# EAGLE design MainBoard (EAGLE 8.5.0)
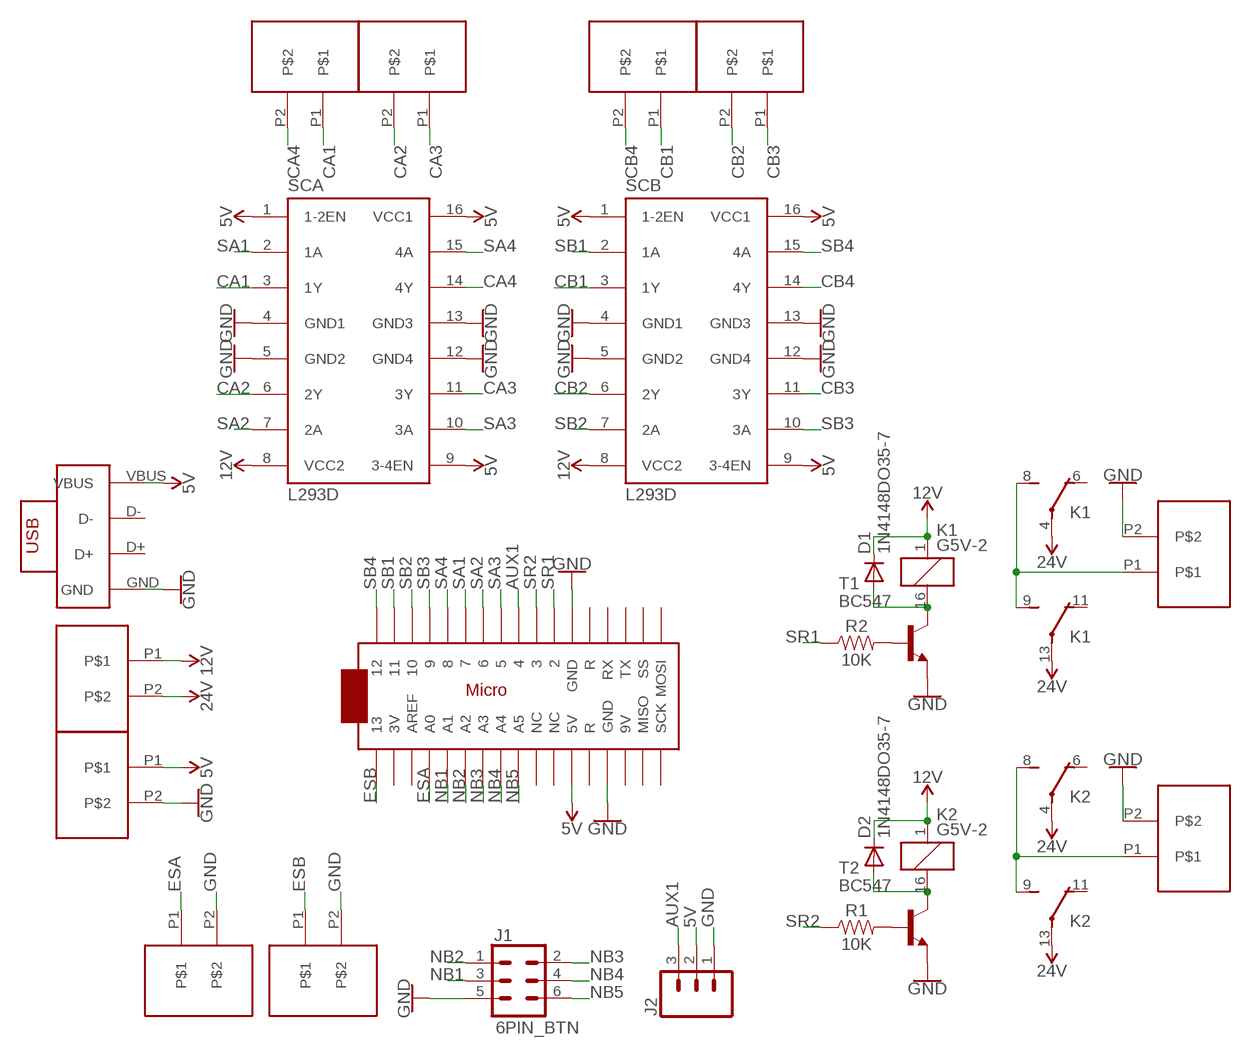
[diagram p0: schematic, sheet 1]

## Parts
5V/GND  PRT-08432  [PRT-08432]
12/24V  PRT-08432  [PRT-08432]
D1  1N4148DO35-7  [DO35-7]
D2  1N4148DO35-7  [DO35-7]
ESA  PRT-08432  [PRT-08432]
ESB  PRT-08432  [PRT-08432]
J1  6PIN_BTN  CONN_03X22X3_SILK_MALE_PTH  [2X3]
J2  CONN_03  [1X03]
K1  G5V-2  [G5V-2]
K2  G5V-2  [G5V-2]
R1  10K  RESISTORAXIAL-0.3  [AXIAL-0.3]
R2  10K  RESISTORAXIAL-0.3  [AXIAL-0.3]
SCA  L293D  [DIL16]
SCA12  PRT-08432  [PRT-08432]
SCA34  PRT-08432  [PRT-08432]
SCB  L293D  [DIL16]
SCB12  PRT-08432  [PRT-08432]
SCB34  PRT-08432  [PRT-08432]
SR1  PRT-08432  [PRT-08432]
SR2  PRT-08432  [PRT-08432]
T1  BC547  [TO92]
T2  BC547  [TO92]
U$1  ARDUINOMICRO  [ARDUINOMICRO]
U$2  USB_EXP_BOARD  [USB_EXPANSION]

## Nets
5V: 5V/GND.P1 J2.2 SCA.1(1-2EN) SCA.9(3-4EN) SCA.16(VCC1) SCB.1(1-2EN) SCB.9(3-4EN) SCB.16(VCC1) U$1.P$23(5V) U$2.VBUS
12V: 12/24V.P1 D1.C D2.C K1.1 K2.1 SCA.8(VCC2) SCB.8(VCC2)
AUX1: J2.3 U$1.P$9
CA1: SCA12.P1 SCA.3(1Y)
CA2: SCA34.P2 SCA.6(2Y)
CA3: SCA34.P1 SCA.11(3Y)
CA4: SCA12.P2 SCA.14(4Y)
CB1: SCB12.P1 SCB.3(1Y)
CB2: SCB34.P2 SCB.6(2Y)
CB3: SCB34.P1 SCB.11(3Y)
CB4: SCB12.P2 SCB.14(4Y)
ESA: ESA.P1 U$1.P$31(A0)
ESB: ESB.P1 U$1.P$34
GND: 5V/GND.P2 ESA.P2 ESB.P2 J1.5 J2.1 SCA.4(GND1) SCA.5(GND2) SCA.12(GND4) SCA.13(GND3) SCB.4(GND1) SCB.5(GND2) SCB.12(GND4) SCB.13(GND3) SR1.P2 SR2.P2 T1.1(E) T2.1(E) U$1.P$12(GND) U$1.P$21(GND) U$2.GND
N$1: D2.A K2.16 T2.3(C)
N$3: D1.A K1.16 T1.3(C)
N$5: R1.P$2 T2.2(B)
N$6: R2.P$2 T1.2(B)
NB1: J1.3 U$1.P$30(A1)
NB2: J1.1 U$1.P$29(A2)
NB3: J1.2 U$1.P$28(A3)
NB4: J1.4 U$1.P$27(A4)
NB5: J1.6 U$1.P$26(A5)
RT1: K1.8(1:S) K1.9(2:S) SR1.P1
RT2: K2.8(1:S) K2.9(2:S) SR2.P1
SA1: SCA.2(1A) U$1.P$6
SA2: SCA.7(2A) U$1.P$7
SA3: SCA.10(3A) U$1.P$8
SA4: SCA.15(4A) U$1.P$5
SB1: SCB.2(1A) U$1.P$2
SB2: SCB.7(2A) U$1.P$3
SB3: SCB.10(3A) U$1.P$4
SB4: SCB.15(4A) U$1.P$1
SR1: R2.P$1 U$1.P$11
SR2: R1.P$1 U$1.P$10
VCC: 12/24V.P2 K1.4(1:P) K1.13(2:P) K2.4(1:P) K2.13(2:P) ; supply symbol labelled 24V
Unconnected: K1.6(1:O) K1.11(2:O) K2.6(1:O) K2.11(2:O) U$1.P$13(R) U$1.P$14(RX) U$1.P$15(TX) U$1.P$16(SS) U$1.P$17(MOSI) U$1.P$18(SCK) U$1.P$19(MISO) U$1.P$20(9V) U$1.P$22(R) U$1.P$24(NC) U$1.P$25(NC) U$1.P$32(AREF) U$1.P$33(3V) U$2.D+ U$2.D-

## Library data of the parts
5V/GND 12/24V ESA ESB SCA12 SCA34 SCB12 SCB34 SR1 SR2 = Screw Terminals:PRT-08432: Two pin screw terminal
D1 D2 = HTXstuff:1N4148: DIODE high speed (Philips)
J1 = SparkFun-Connectors:CONN_03X2: Multi connection point. Often used as Generic Header-pin footprint for 0.1 inch spaced/style header connections You can populate with any combo of single row headers, but if you'd like an exact match, check these: Header - 2x3 (Male, 0.1") <https://www.sparkfun.com/products/12807> (PRT-12807) Header - 2x3 (Female, 0.1") <https://www.sparkfun.com/products/13010> (PRT-13010) 2x3 Pin Shrouded Header <https://www.sparkfun.com/products/10877> (PRT-10877) On any of the 0.1 inch spaced packages, you can populate with these: Break Away Headers - Straight <https://www.sparkfun.com/products/116> (PRT-00116) Break Away Male Headers - Right Angle <https://www.sparkfun.com/products/553> (PRT-00553) Female Headers <https://www.sparkfun.com/products/115> (PRT-00115) Break Away Headers - Machine Pin <https://www.sparkfun.com/products/117> (PRT-00117) Break Away Female Headers - Swiss Machine Pin <https://www.sparkfun.com/products/743> (PRT-00743) Special note: the shrouded connector mates well with our 3x2 ribbon cables: Ribbon Crimp Connector - 6-pin (2x3, Female) <https://www.sparkfun.com/products/10651> (PRT-10651) Ribbon Cable - 6 wire (15ft) <https://www.sparkfun.com/products/10646> (PRT-10646); PROD_ID: CONN-09701
J2 = SparkFun-Connectors:CONN_03: Multi connection point. Often used as Generic Header-pin footprint for 0.1 inch spaced/style header connections On any of the 0.1 inch spaced packages, you can populate with these: Break Away Headers - Straight <https://www.sparkfun.com/products/116> (PRT-00116) Break Away Male Headers - Right Angle <https://www.sparkfun.com/products/553> (PRT-00553) Female Headers <https://www.sparkfun.com/products/115> (PRT-00115) Break Away Headers - Machine Pin <https://www.sparkfun.com/products/117> (PRT-00117) Break Away Female Headers - Swiss Machine Pin <https://www.sparkfun.com/products/743> (PRT-00743) Stackable Header - 3 Pin (Female, 0.1") <https://www.sparkfun.com/products/13875> (PRT-13875) For SCREWTERMINALS and SPRING TERMINALS visit here: Screw Terimnals on SparkFun.com <https://www.sparkfun.com/search/results?term=Screw+Terminals> (5mm/3.5mm/2.54mm spacing) This device is also useful as a general connection point to wire up your design to another part of your project. Our various solder wires solder well into these plated through hole pads. Hook-Up Wire - Assortment (Stranded, 22 AWG) <https://www.sparkfun.com/products/11375> (PRT-11375) Hook-Up Wire - Assortment (Solid Core, 22 AWG) <https://www.sparkfun.com/products/11367> (PRT-11367) View the entire wire category on our website here <https://www.sparkfun.com/categories/141> Special notes: Molex polarized connector foot print use with SKU : PRT-08232 with associated crimp pins and housings.
K1 K2 = relay:G5V-2: OMRON PCB Relay Source: http://www.omron.com/ecb/products/pdf/en-g5v2.pdf; MPN: G5V-2 5DC; OC_FARNELL: 9949488; OC_NEWARK: 78K5703
R1 R2 = SparkFun-Resistors:RESISTOR: Generic Resistor Package
SCA SCB = HTXstuff:L293D: PUSH-PULL 4 CHANNEL DRIVER; MPN: L293D; OC_FARNELL: 9589619; OC_NEWARK: 56P8249
T1 T2 = HTXstuff:BC547: NPN TRANSISTOR
U$1 = HTXstuff:ARDUINOMICRO
U$2 = HTXstuff:USB_EXP_BOARD

## Board
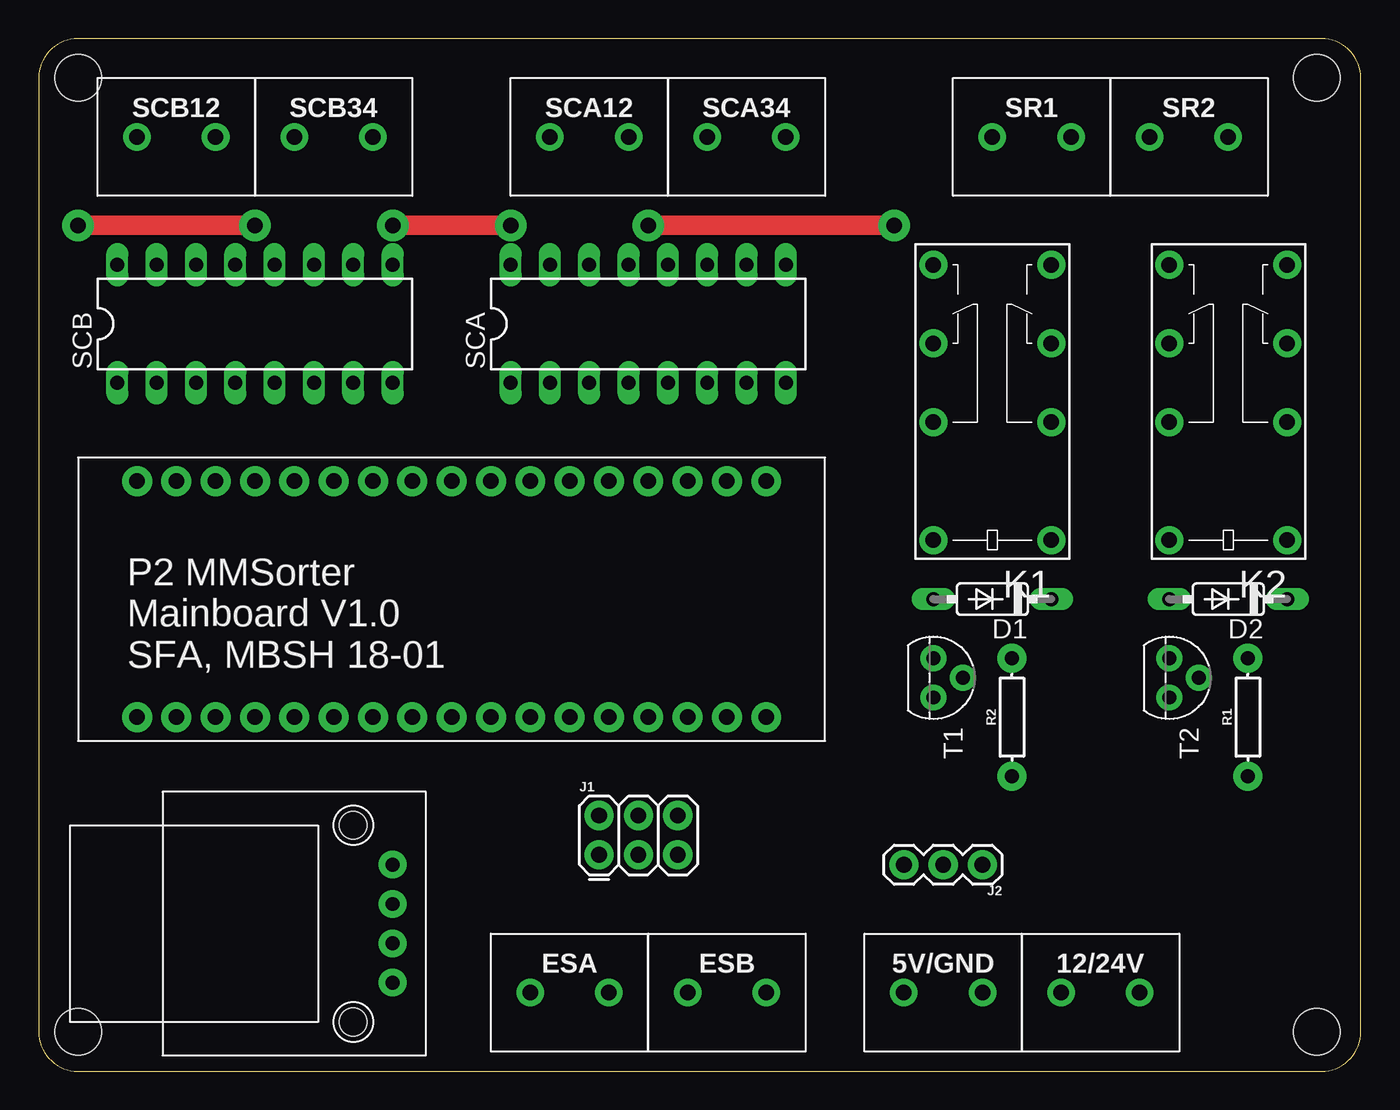
[diagram p1: board, top side]
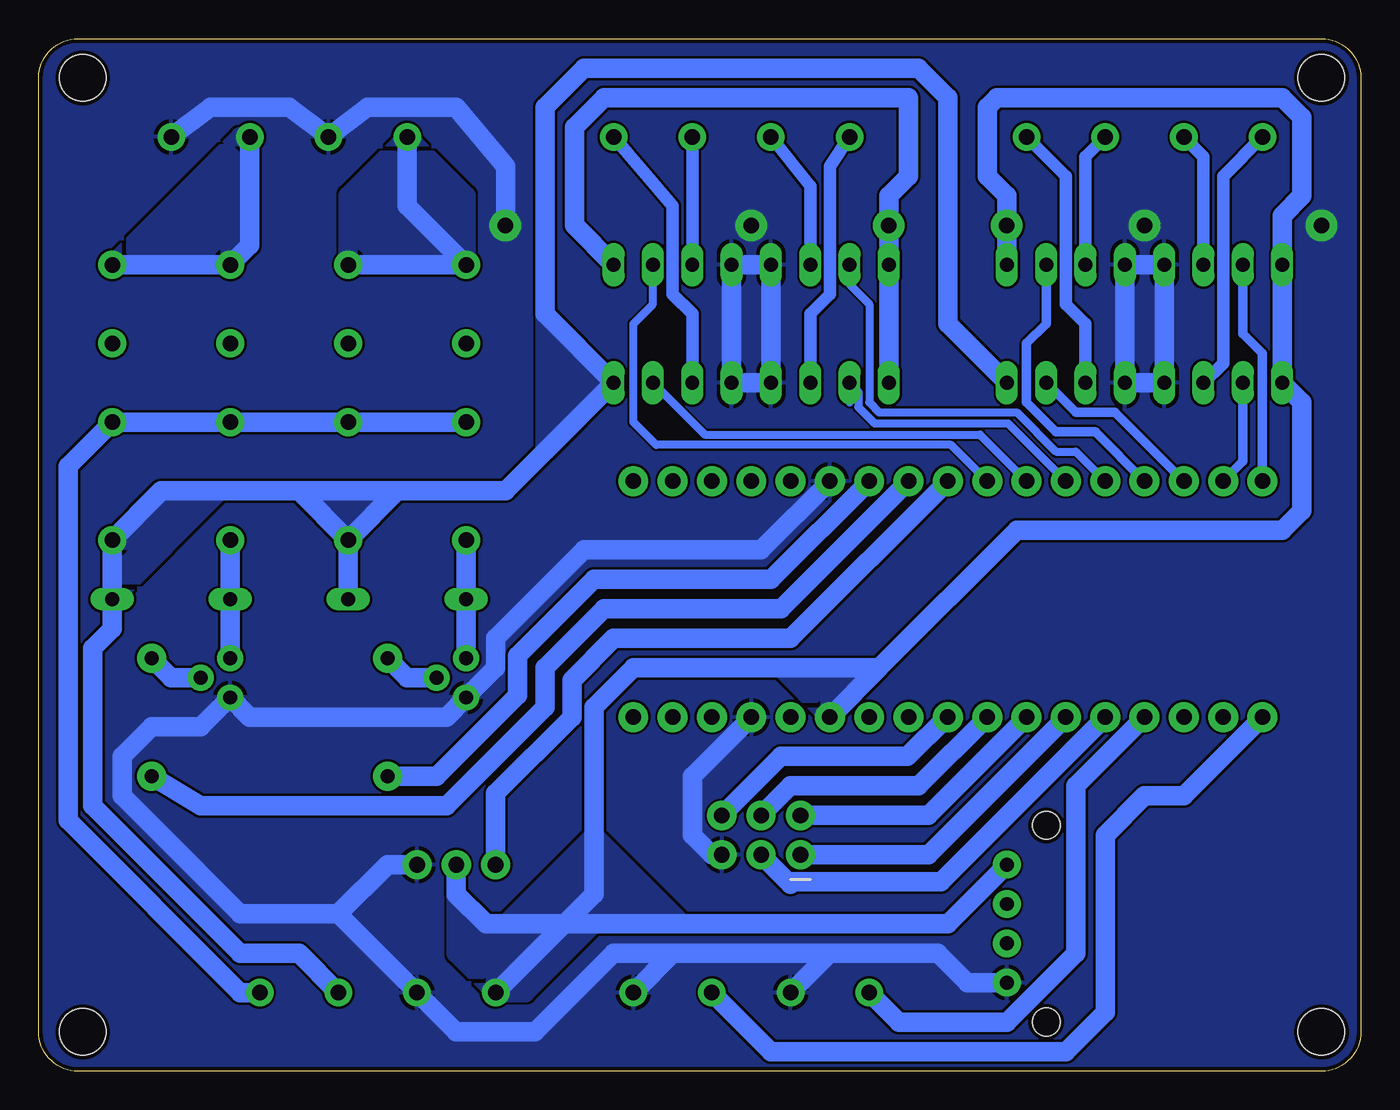
[diagram p2: board, bottom side, seen from below]

Size 85.39 x 66.67 mm. Coordinates in mm from the lower left corner, seen from the top.
Outline: 0,64.12 0,2.54 arc90 2.54,0 82.86,0 arc90 85.39,2.54 85.39,64.12 arc90 82.86,66.67 2.54,66.67 arc90 0,64.12
Copper layers (1*16): Top 0.035mm / dielectric 1.5mm / Bottom 0.035mm
Design rules "default *": minimum track width 6mil, minimum drill 0.35mm, track to track 6mil, track to pad 6mil, pad to pad 6mil, via to via 6mil, smd to smd 6mil, copper to edge 10mil, drill to drill 10mil, minimum pad ring 10mil, minimum via ring 8mil, stop-mask expansion 4mil, vias tented up to drill 0mil, thermal gap 10mil
Holes 3 mm at 2.54,64.14 82.55,64.14 82.55,2.54 2.54,2.54
Holes 1.78 mm at 20.32,3.17 20.32,15.88

### Footprints (pad centres in the part's own frame; a part is rotated, then mirrored left to right if it is on the bottom)
PRT-08432 = drill 1 pad 1.778: P1 0,0; P2 5.08,0
DO35-7 = drill 0.9 long: A 3.81,0; C -3.81,0
2X3 = drill 1.016 pad 1.88: 1 0,0; 2 0,2.54; 3 2.54,0; 4 2.54,2.54; 5 5.08,0; 6 5.08,2.54
1X03 = drill 1.016 pad 1.88: 1 0,0; 2 2.54,0; 3 5.08,0
G5V-2 = drill 1 pad 1.8: 1 -8.89,-3.81; 4 -1.27,-3.81; 6 3.81,-3.81; 8 8.89,-3.81; 9 8.89,3.81; 11 3.81,3.81; 13 -1.27,3.81; 16 -8.89,3.81
AXIAL-0.3 = drill 0.9 pad 1.88: P$1 -3.81,0; P$2 3.81,0
DIL16 = drill 0.9 long: 1 -8.89,-3.81; 2 -6.35,-3.81; 3 -3.81,-3.81; 4 -1.27,-3.81; 5 1.27,-3.81; 6 3.81,-3.81; 7 6.35,-3.81; 8 8.89,-3.81; 9 8.89,3.81; 10 6.35,3.81; 11 3.81,3.81; 12 1.27,3.81; 13 -1.27,3.81; 14 -3.81,3.81; 15 -6.35,3.81; 16 -8.89,3.81
TO92 = drill 0.9 pad 1.676: 1 1.27,0; 2 0,1.905; 3 -1.27,0
ARDUINOMICRO = drill 1 pad 1.93: P$1 -20.32,7.62; P$2 -17.78,7.62; P$3 -15.24,7.62; P$4 -12.7,7.62; P$5 -10.16,7.62; P$6 -7.62,7.62; P$7 -5.08,7.62; P$8 -2.54,7.62; P$9 0,7.62; P$10 2.54,7.62; P$11 5.08,7.62; P$12 12.7,-7.62; P$13 10.16,-7.62; P$14 12.7,7.62; P$15 15.24,7.62; P$16 17.78,7.62; P$17 20.32,7.62; P$18 20.32,-7.62; P$19 17.78,-7.62; P$20 15.24,-7.62; P$21 7.62,7.62; P$22 10.16,7.62; P$23 7.62,-7.62; P$24 5.08,-7.62; P$25 2.54,-7.62; P$26 0,-7.62; P$27 -2.54,-7.62; P$28 -5.08,-7.62; P$29 -7.62,-7.62; P$30 -10.16,-7.62; P$31 -12.7,-7.62; P$32 -15.24,-7.62; P$33 -17.78,-7.62; P$34 -20.32,-7.62
USB_EXPANSION = drill 0.9 pad 1.778: D+ -1.27,-6.35; D- 1.27,-6.35; GND -3.81,-6.35; VBUS 3.81,-6.35

### Placement (x,y rotation side)
5V/GND  55.88,5.08 0 top
12/24V  66.04,5.08 0 top
D1  61.59,30.48 180 top
D2  76.83,30.48 180 top
ESA  31.75,5.08 0 top
ESB  41.91,5.08 0 top
J1  36.2,13.97 0 top
J2  60.96,13.34 180 top
K1  61.59,43.18 90 top
K2  76.83,43.18 90 top
R1  78.11,22.86 90 top
R2  62.87,22.86 90 top
SCA  39.37,48.26 0 top
SCA12  33.02,60.33 0 top
SCA34  43.18,60.33 0 top
SCB  13.97,48.26 0 top
SCB12  6.35,60.33 0 top
SCB34  16.51,60.33 0 top
SR1  61.59,60.33 0 top
SR2  71.75,60.33 0 top
T1  57.78,25.4 270 top
T2  73.03,25.4 270 top
U$1  26.67,30.48 0 top
U$2  16.51,9.53 90 top

### Tracks (layer width: path | path; a pad name or v marks a point on that pad's centre or on a via)
5V  (via drill 1 pad 2.03)
  Top 1.27: v22.86,54.61 v30.48,54.61
  Bottom 1.27: 31.11,26.04 22.23,34.92 5.08,34.92 3.81,36.2 3.81,43.18 SCB.1 SCB.16 5.08,55.24 3.81,56.52 3.81,61.59 5.08,62.87 23.5,62.87 24.13,62.23 24.13,57.78 22.86,56.52 v22.86,54.61 SCB.9 | 31.11,26.04 U$1.P$23 | SCA.1 SCA.16 v30.48,54.61 30.48,56.52 29.21,57.78 29.21,62.87 48.9,62.87 50.8,60.96 50.8,54.61 SCA.9 | U$2.VBUS 26.67,9.53 51.44,9.53 | 51.44,9.53 5V/GND.P1 | 51.44,9.53 49.53,11.43 49.53,23.5 46.99,26.04 31.11,26.04 | J2.2 58.42,11.43 56.52,9.53 51.44,9.53
  pour Bottom: 55.88,5.08 58.42,7.62 58.42,11.43 56.52,9.53 55.24,9.53 49.53,15.24 43.81,9.53 49.53,9.53 53.98,5.08
  pour Bottom: 34.29,22.86 37.47,26.04 31.11,26.04
12V
  Bottom 1.27: K1.1 D1.C | K1.1 68.58,37.47 | 68.58,37.47 77.47,37.47 K2.1 D2.C 80.64,28.57 81.92,27.3 81.92,17.14 72.39,7.62 68.58,7.62 12/24V.P1 | 62.23,37.47 55.24,37.47 SCA.8 52.7,48.9 52.7,62.23 50.16,64.77 28.57,64.77 26.67,62.87 26.67,48.26 SCB.8 | 62.23,37.47 68.58,37.47 | K1.1 62.23,37.47
  pour Bottom: 65.41,34.29 62.23,37.47 68.58,37.47
  pour Bottom: 48.26,44.45 52.7,48.9 52.7,40.01
  pour Bottom: 80.64,30.48 73.66,37.47 77.47,37.47 80.64,34.29
AUX1
  Bottom 1.27: U$1.P$9 36.83,27.94 48.26,27.94 50.95,25.25 50.95,22.86 55.88,17.93 J2.3
CA1
  Bottom 0.813: SCA.3 35.56,48.9 34.29,50.16 34.29,58.42 SCA12.P1
CA2
  Bottom 0.813: SCA34.P2 44.45,55.88 44.45,50.16 43.18,48.9 SCA.6
CA3
  Bottom 0.813: SCA.11 SCA34.P1
CA4
  Bottom 0.813: SCA.14 35.56,57.15 SCA12.P2
CB1
  Bottom 0.813: SCB12.P1 8.89,57.78 8.89,45.72 SCB.3
CB2
  Bottom 0.813: SCB34.P2 19.05,57.78 19.05,49.53 17.78,48.26 SCB.6
CB3
  Bottom 0.813: SCB.11 17.78,59.05 SCB34.P1
CB4
  Bottom 0.813: SCB.14 10.16,59.05 SCB12.P2
ESA
  Bottom 1.27: U$1.P$31 18.41,18.41 18.41,7.62 22.86,3.17 29.84,3.17 ESA.P1
ESB
  Bottom 1.27: U$1.P$34 11.43,17.78 13.97,17.78 16.51,15.24 16.51,3.81 19.05,1.27 38.1,1.27 ESB.P1
GND  (via drill 1 pad 2.03)
  Top 1.27: v39.37,54.61 v55.24,54.61 | v13.97,54.61 v2.54,54.61
  Bottom 1.27: SR2.P2 74.3,62.23 69.22,62.23 SR1.P2 64.14,62.23 58.42,62.23 55.24,58.42 v55.24,54.61 | U$1.P$21 38.73,33.66 50.16,33.66 55.88,27.94 55.88,26.04 T1.1 59.05,22.86 71.75,22.86 T2.1 74.93,22.23 78.11,22.23 80.01,20.32 80.01,17.78 72.39,10.16 66.04,10.16 | U$2.GND 25.4,5.71 27.3,7.62 34.29,7.62 | 34.29,7.62 ESA.P2 | 34.29,7.62 44.45,7.62 | 44.45,7.62 ESB.P2 | 44.45,7.62 48.26,7.62 53.34,2.54 58.42,2.54 5V/GND.P2 66.04,10.16 | J1.5 41.91,13.97 43.18,15.24 43.18,19.05 U$1.P$12 | J2.1 62.87,13.34 66.04,10.16 | SCB.4 SCB.5 SCB.12 SCB.13 SCB.4 | SCA.13 SCA.12 SCA.5 SCA.4 SCA.13
  pour Bottom (rank 6): -0.64,67.31 86.36,67.31 86.36,-0.64 -0.64,-0.64
N$1
  Bottom 1.27: K2.16 D2.A T2.3
N$3
  Bottom 1.27: K1.16 D1.A T1.3
N$5
  Bottom 1.27: R1.P$2 76.83,25.4 T2.2
N$6
  Bottom 1.27: R2.P$2 61.59,25.4 T1.2
NB1
  Bottom 1.27: J1.3 36.83,12.06 36.65,12.24 27.13,12.24 U$1.P$30
NB2
  Bottom 1.27: J1.1 27.94,13.97 U$1.P$29
NB3
  Bottom 1.27: U$1.P$28 27.94,16.51 J1.2
NB4
  Bottom 1.27: U$1.P$27 28.57,18.41 36.83,18.41 J1.4
NB5
  Bottom 1.27: J1.6 37.47,20.32 29.27,20.32 26.73,22.86 U$1.P$26
RT1
  Bottom 1.27: K1.8 K1.9 61.59,55.88 SR1.P1
  pour Bottom (rank 2): 57.78,52.07 57.78,56.52 61.59,60.33 65.41,56.52 65.41,52.07
RT2
  Bottom 1.27: SR2.P1 71.75,53.34 K2.9 K2.8
  pour Bottom: 71.75,60.33 72.39,60.33 80.64,52.07 73.03,52.07 71.75,53.34
SA1
  Bottom 0.508: U$1.P$6 22.78,41.83 31.41,41.83 32.46,42.88 32.46,43.89 SCA.2 33.02,43.18
SA2
  Bottom 0.508: U$1.P$7 24.59,41.1 42.37,41.1 SCA.7
SA3
  Bottom 0.508: U$1.P$8 26.47,40.44 45.52,40.44 46.99,41.91 46.99,48.26 45.72,49.53 SCA.10
SA4
  Bottom 0.508: SCA.15 33.02,50.8 31.75,49.53 31.75,43.18 31.11,42.55 22.23,42.55 19.68,40.01 18.41,40.01 U$1.P$5
SB1
  Bottom 0.61: SCB.2 7.62,39.37 U$1.P$2
SB2
  Bottom 0.61: SCB.7 18.41,42.55 15.88,42.55 U$1.P$3
SB3
  Bottom 0.61: U$1.P$4 17.14,41.27 19.68,41.27 21.59,43.18 21.59,46.99 20.32,48.26 SCB.10
SB4
  Bottom 0.61: SCB.15 7.62,47.62 6.35,46.35 U$1.P$1
SR1
  Bottom 1.27: R2.P$1 59.69,19.05 54.46,24.28 54.46,26.82 49.53,31.75 38.1,31.75 U$1.P$11
SR2
  Bottom 1.27: R1.P$1 74.93,17.14 59.05,17.14 52.7,23.5 52.7,26.04 48.9,29.84 37.47,29.84 U$1.P$10
VCC
  Bottom 1.27: K1.13 K1.4 K2.13 K2.4 83.5,39.05 83.5,16.19 72.39,5.08 12/24V.P2

### Text on the board
tNames: P2 MMSorter / Mainboard V1.0 / SFA, MBSH 18-01